# EAGLE design sca (EAGLE 9.5.1)

## Sheet 1 of 4
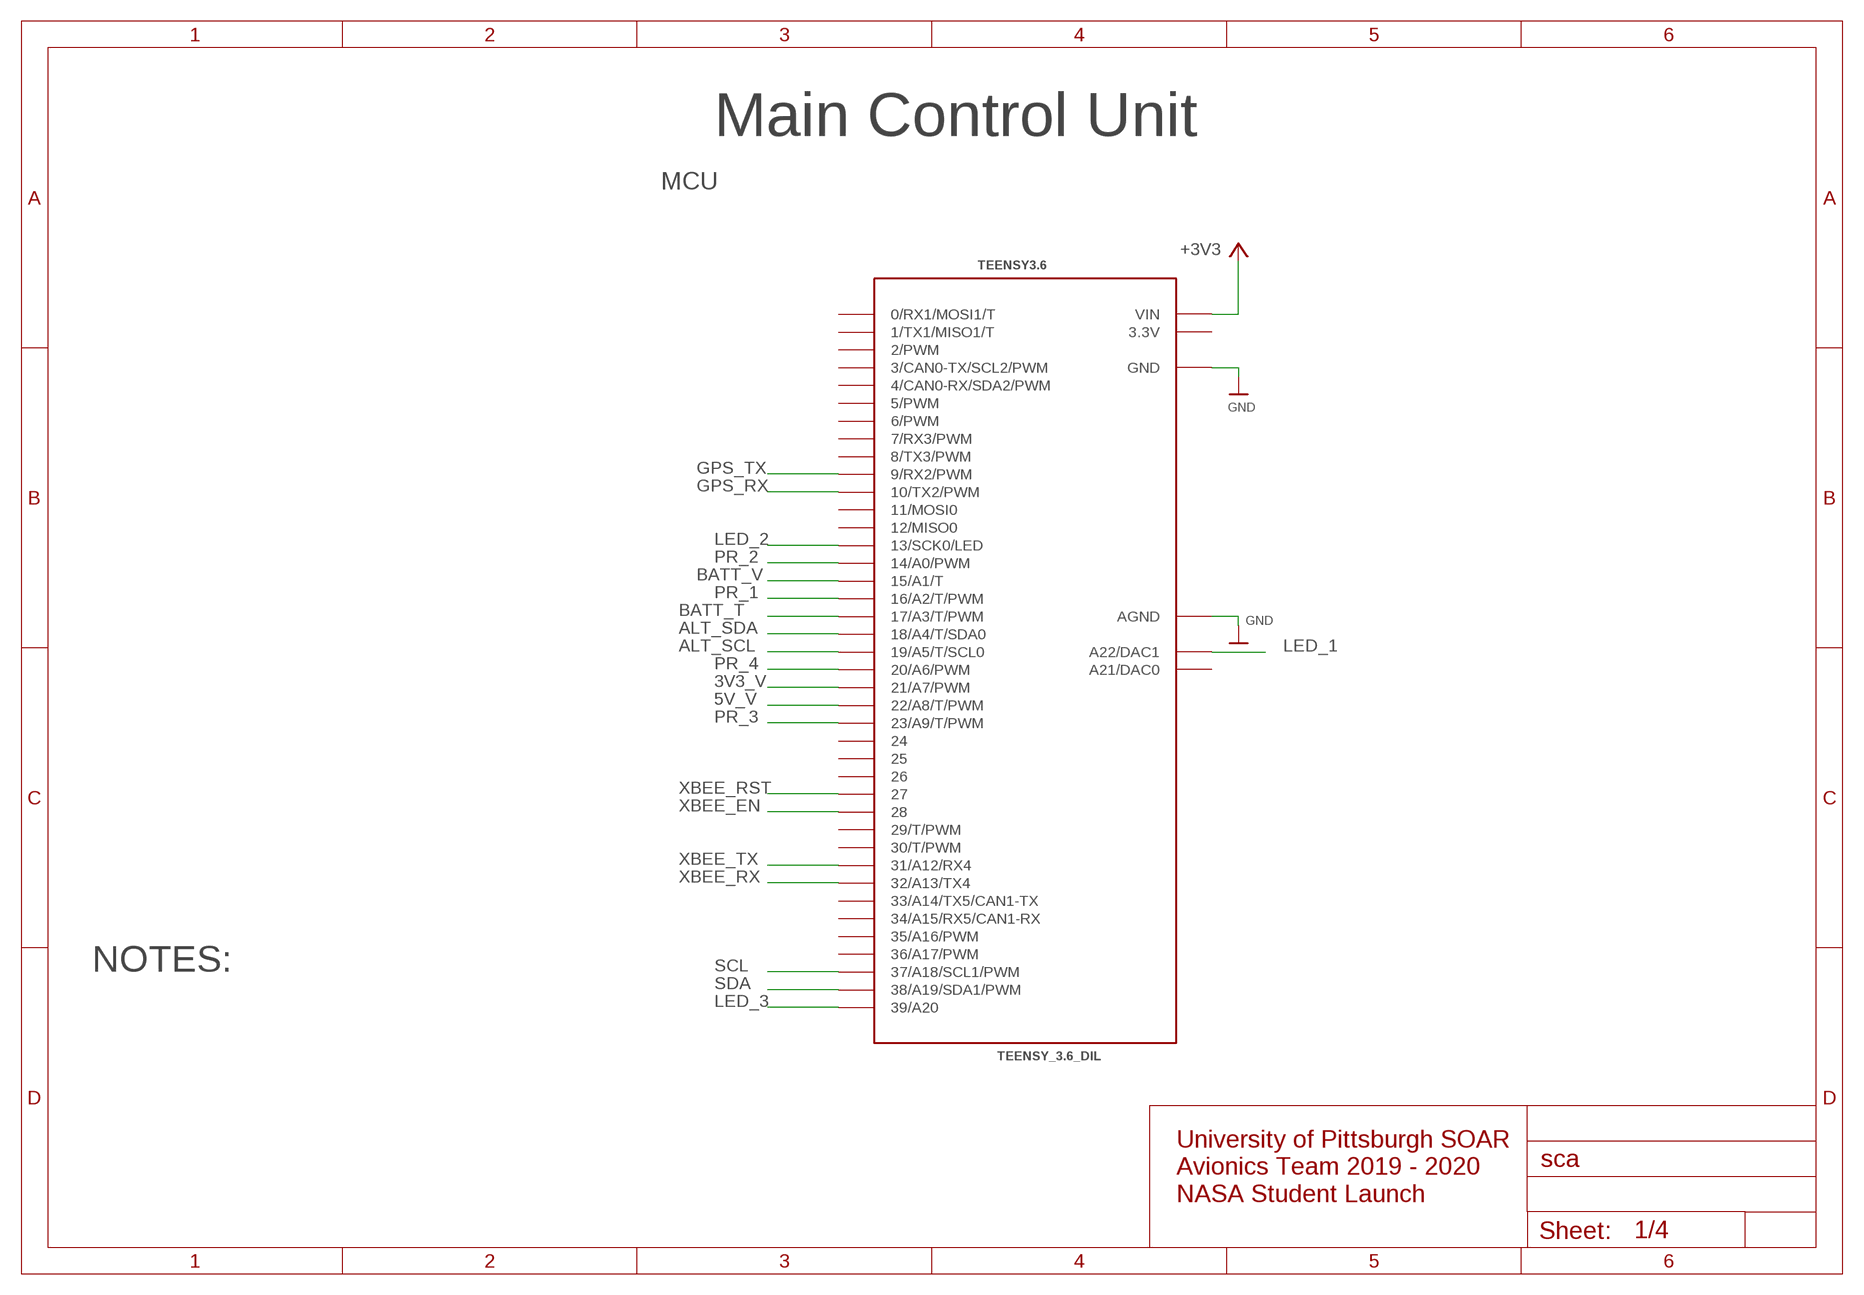
[diagram p0: schematic, sheet 1]

### Parts
TEENSY3.6  TEENSY_3.6_DIL  [TEENSY_3.6_DIL]

### Nets
3V3_V: TEENSY3.6.21/A7(21/A7/PWM) ; also sheet 4
5V_V: TEENSY3.6.22/A8(22/A8/T/PWM) ; also sheet 4
+3V3: TEENSY3.6.VIN ; also sheet 2,3,4
ALT_SCL: TEENSY3.6.19/A5(19/A5/T/SCL0) ; also sheet 3
ALT_SDA: TEENSY3.6.18/A4(18/A4/T/SDA0) ; also sheet 3
BATT_T: TEENSY3.6.17/A3(17/A3/T/PWM) ; also sheet 4
BATT_V: TEENSY3.6.15/A1(15/A1/T) ; also sheet 4
GND: TEENSY3.6.AGND TEENSY3.6.GND TEENSY3.6.GND1(GND) ; also sheet 2,3,4
GPS_RX: TEENSY3.6.10(10/TX2/PWM) ; also sheet 3
GPS_TX: TEENSY3.6.9(9/RX2/PWM) ; also sheet 3
LED_1: TEENSY3.6.A22(A22/DAC1) ; also sheet 4
LED_2: TEENSY3.6.13(13/SCK0/LED) ; also sheet 4
LED_3: TEENSY3.6.39/A20 ; also sheet 4
PR_1: TEENSY3.6.16/A2(16/A2/T/PWM) ; also sheet 4
PR_2: TEENSY3.6.14/A0(14/A0/PWM) ; also sheet 4
PR_3: TEENSY3.6.23/A9(23/A9/T/PWM) ; also sheet 4
PR_4: TEENSY3.6.20/A6(20/A6/PWM) ; also sheet 4
SCL: TEENSY3.6.37/A18(37/A18/SCL1/PWM) ; also sheet 3
SDA: TEENSY3.6.38/A19(38/A19/SDA1/PWM) ; also sheet 3
XBEE_EN: TEENSY3.6.28 ; also sheet 3
XBEE_RST: TEENSY3.6.27 ; also sheet 3
XBEE_RX: TEENSY3.6.32/A13(32/A13/TX4) ; also sheet 3
XBEE_TX: TEENSY3.6.31/A12(31/A12/RX4) ; also sheet 3
Unconnected: TEENSY3.6.0(0/RX1/MOSI1/T) TEENSY3.6.1(1/TX1/MISO1/T) TEENSY3.6.2(2/PWM) TEENSY3.6.3(3/CAN0-TX/SCL2/PWM) TEENSY3.6.4(4/CAN0-RX/SDA2/PWM) TEENSY3.6.5(5/PWM) TEENSY3.6.6(6/PWM) TEENSY3.6.7(7/RX3/PWM) TEENSY3.6.8(8/TX3/PWM) TEENSY3.6.11(11/MOSI0) TEENSY3.6.12(12/MISO0) TEENSY3.6.24 TEENSY3.6.25 TEENSY3.6.26 TEENSY3.6.29(29/T/PWM) TEENSY3.6.30(30/T/PWM) TEENSY3.6.33/A14(33/A14/TX5/CAN1-TX) TEENSY3.6.34/A15(34/A15/RX5/CAN1-RX) TEENSY3.6.35/A16(35/A16/PWM) TEENSY3.6.36/A17(36/A17/PWM) TEENSY3.6.A21(A21/DAC0)

### Notes on the sheet
- Main Control Unit
- MCU
- NOTES:
- University of Pittsburgh SOAR
  Avionics Team 2019 - 2020
  NASA Student Launch

## Sheet 2 of 4
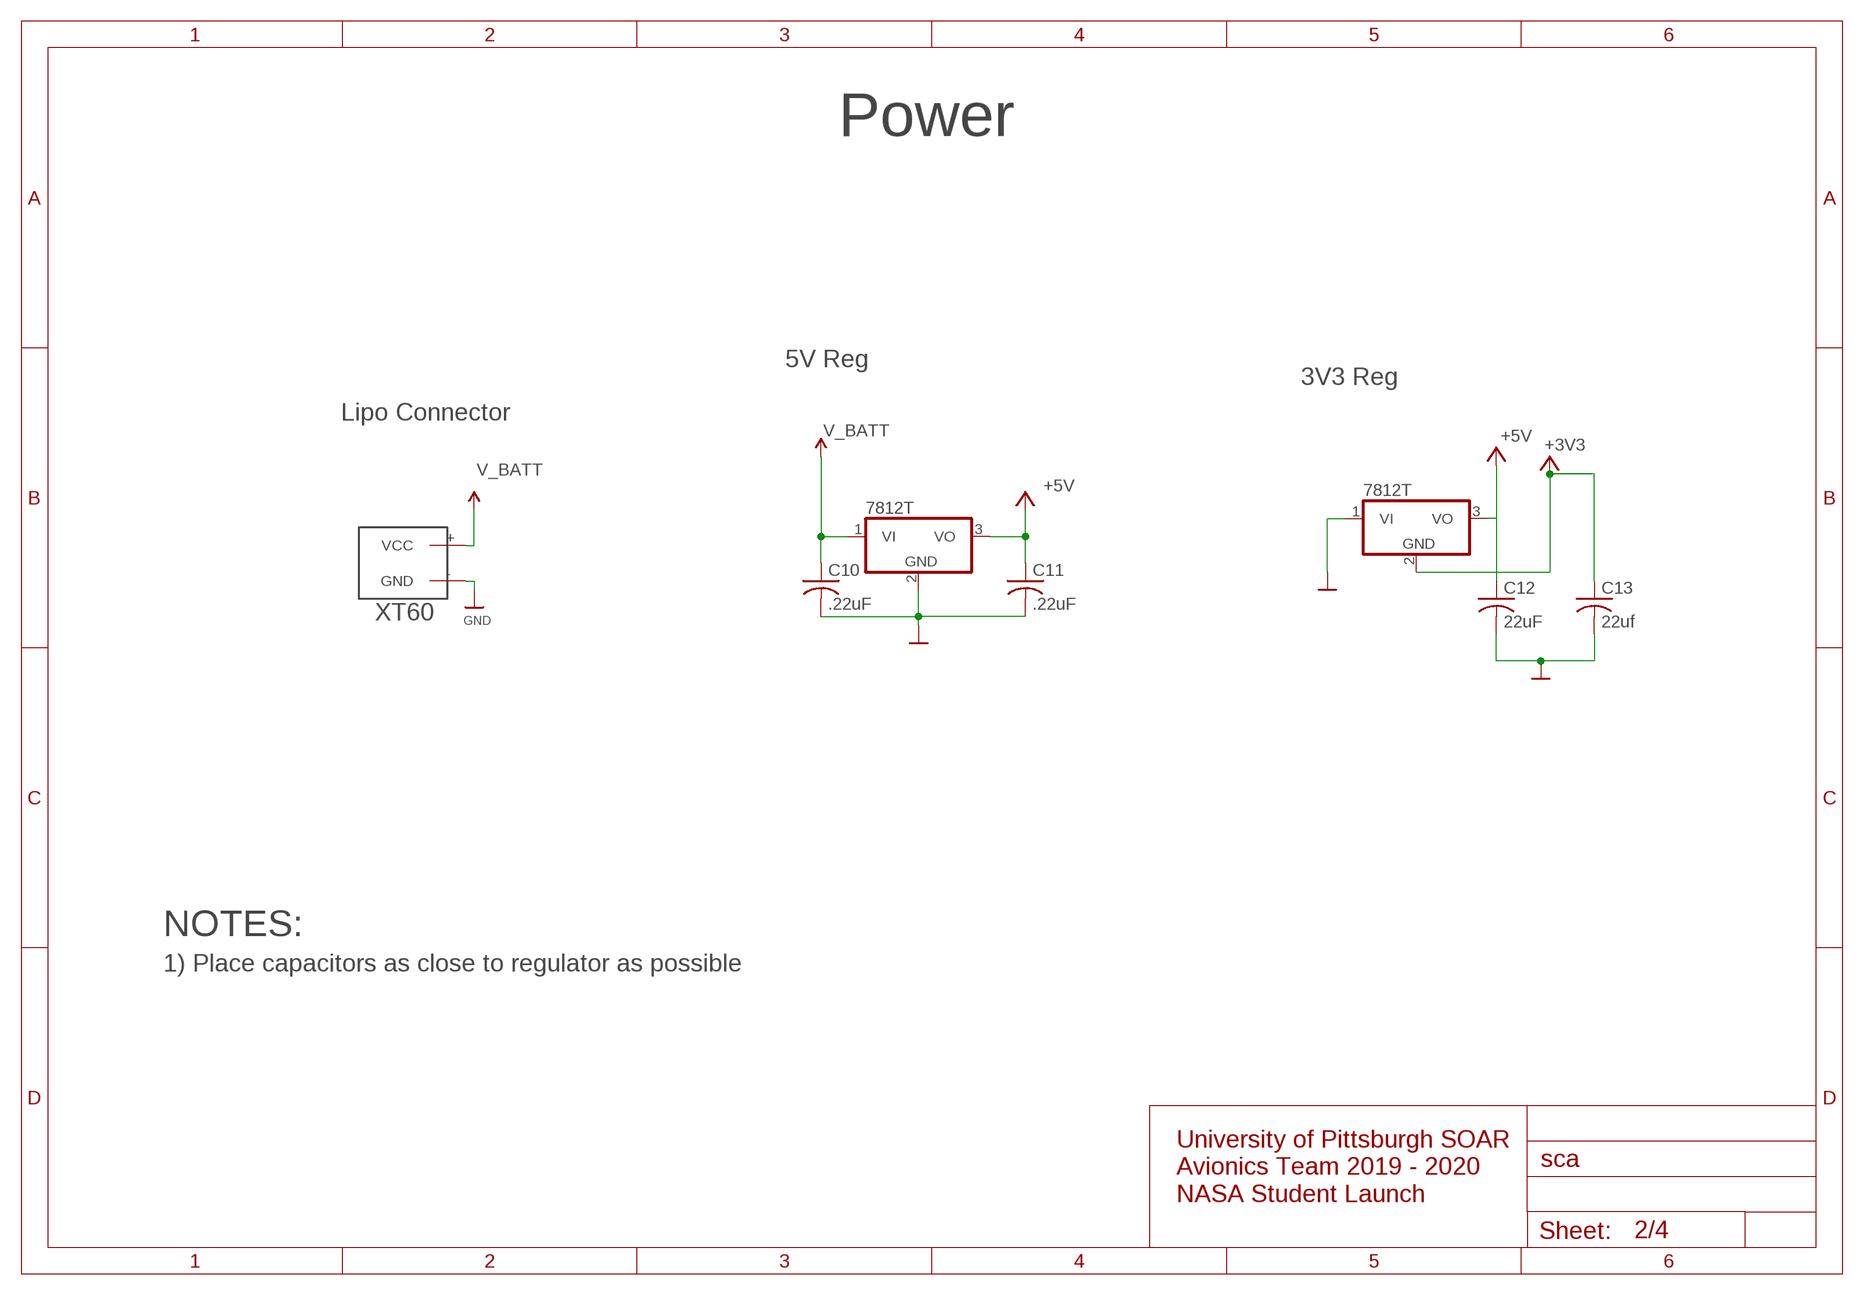
[diagram p1: schematic, sheet 2]

### Parts
3V3_REG  7812T  [TO220H]
5V_REG  7812T  [TO220H]
C10  .22uF  C-US025-040X050  [C025-040X050]
C11  .22uF  C-US025-040X050  [C025-040X050]
C12  22uF  C-US025-040X050  [C025-040X050]
C13  22uf  C-US025-040X050  [C025-040X050]
U$5  XT60  [XT60]

### Nets
+3V3: 3V3_REG.2(GND) C13.1 ; also sheet 1,3,4
+5V: 3V3_REG.3(VO) 5V_REG.3(VO) C11.1 C12.1 ; also sheet 3,4
GND: 3V3_REG.1(VI) 5V_REG.2(GND) C10.2 C11.2 C12.2 C13.2 U$5.-(GND) ; also sheet 1,3,4
V_BATT: 5V_REG.1(VI) C10.1 U$5.+(VCC) ; also sheet 4

### Notes on the sheet
- Power
- 5V Reg
- 3V3 Reg
- Lipo Connector
- NOTES:
- 1) Place capacitors as close to regulator as possible
- University of Pittsburgh SOAR
  Avionics Team 2019 - 2020
  NASA Student Launch

## Sheet 3 of 4
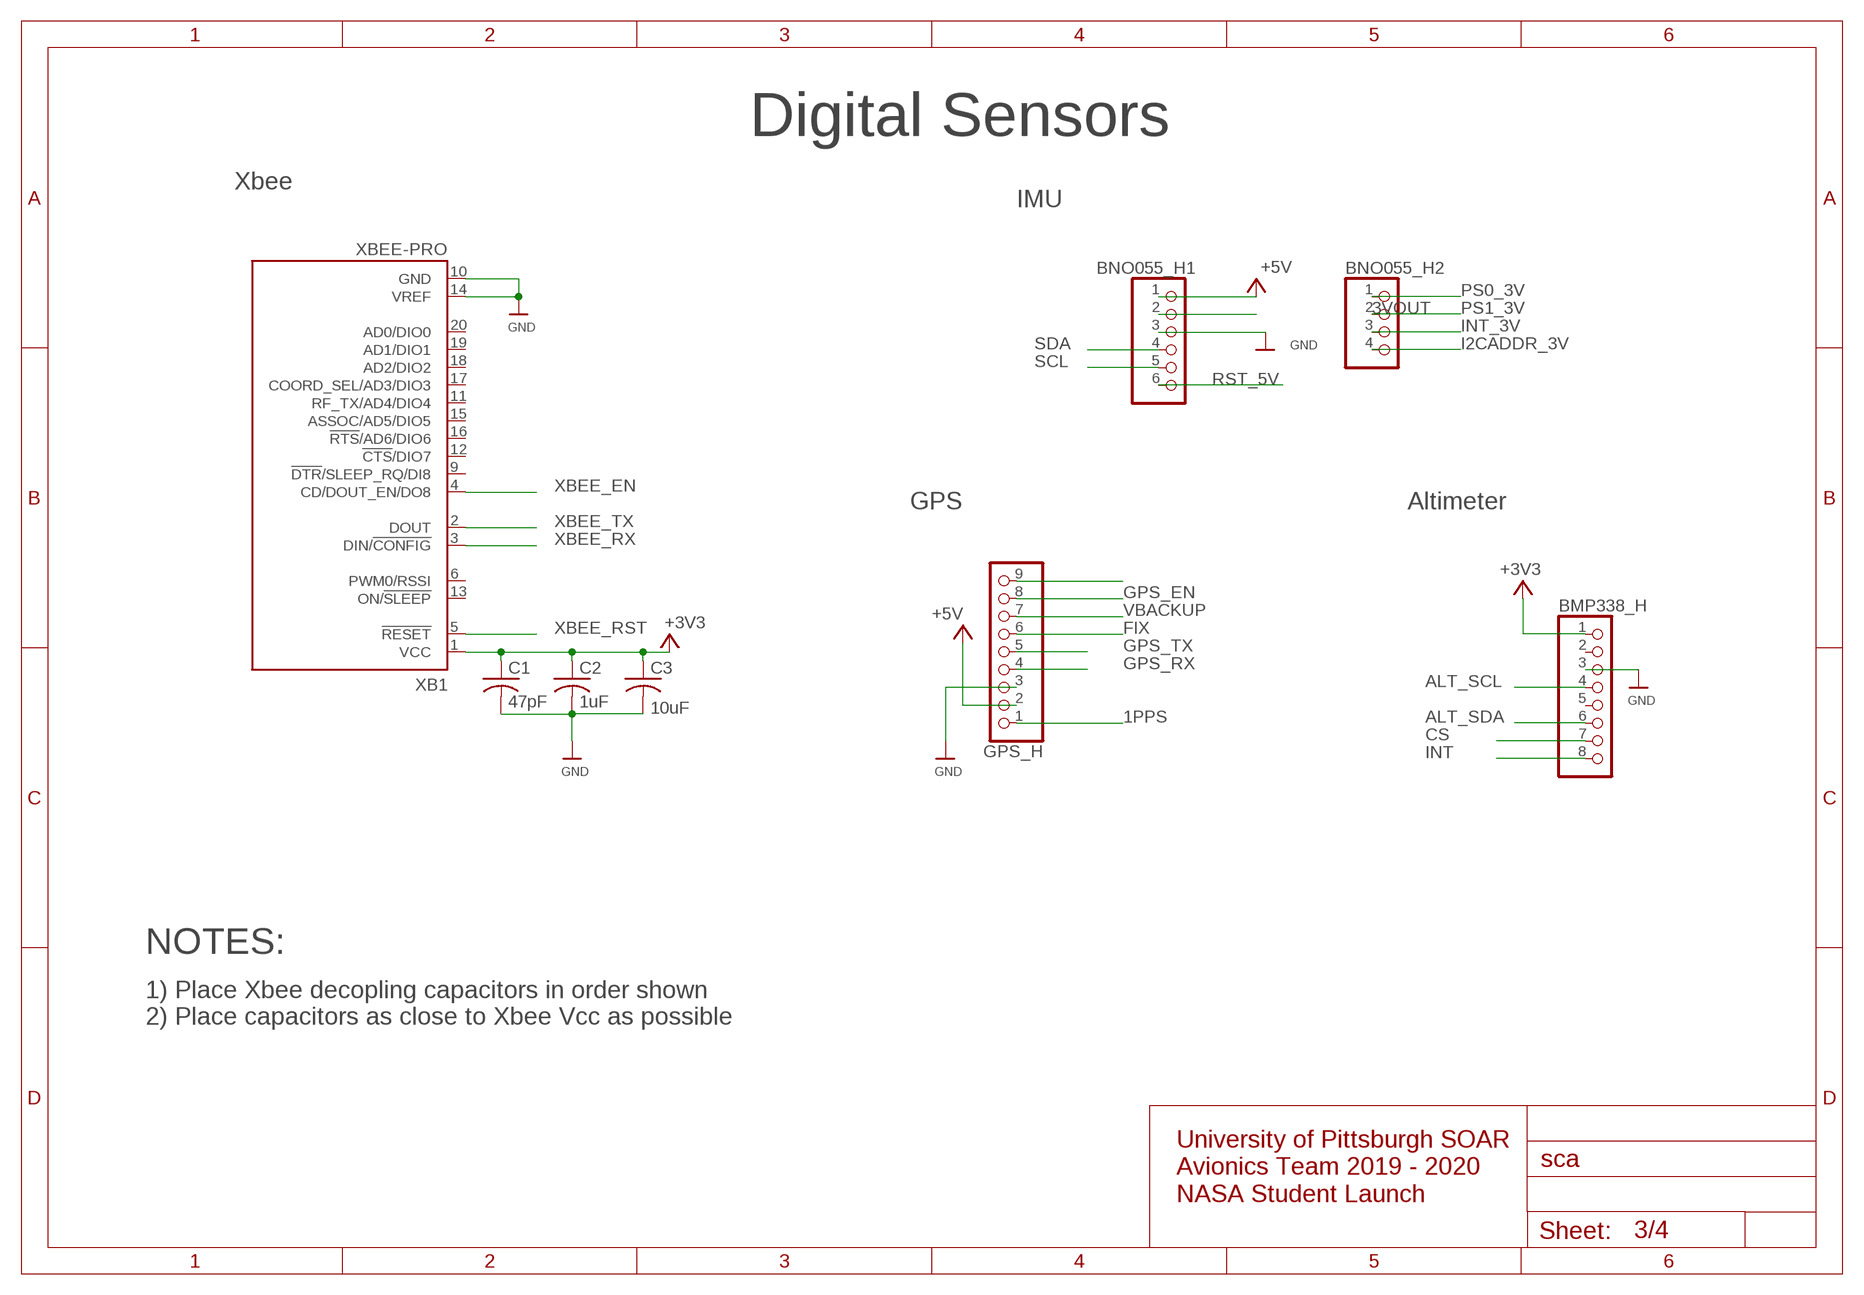
[diagram p2: schematic, sheet 3]

### Parts
BMP338_H  HEADER-1X870MIL  [1X08_ROUND_70]
BNO055_H1  HEADER-1X676MIL  [1X06_ROUND_76]
BNO055_H2  HEADER-1X476MIL  [1X04_ROUND_76]
C1  47pF  C-US025-040X050  [C025-040X050]
C2  1uF  C-US025-040X050  [C025-040X050]
C3  10uF  C-US025-040X050  [C025-040X050]
GPS_H  HEADER-1X970MIL  [1X09_ROUND_70]
XB1  XBEE-PRO  [XBEE-PRO]

### Nets
1PPS: GPS_H.1
3VOUT: BNO055_H1.2
+3V3: BMP338_H.1 C1.1 C2.1 C3.1 XB1.1(VCC) ; also sheet 1,2,4
+5V: BNO055_H1.1 GPS_H.2 ; also sheet 2,4
ALT_SCL: BMP338_H.4 ; also sheet 1
ALT_SDA: BMP338_H.6 ; also sheet 1
CS: BMP338_H.7
FIX: GPS_H.6
GND: BMP338_H.3 BNO055_H1.3 C1.2 C2.2 C3.2 GPS_H.3 XB1.10(GND) XB1.14(VREF) ; also sheet 1,2,4
GPS_EN: GPS_H.8
GPS_RX: GPS_H.4 ; also sheet 1
GPS_TX: GPS_H.5 ; also sheet 1
I2CADDR_3V: BNO055_H2.4
INT: BMP338_H.8
INT_3V: BNO055_H2.3
N$3: GPS_H.9
PS0_3V: BNO055_H2.1
PS1_3V: BNO055_H2.2
RST_5V: BNO055_H1.6
SCL: BNO055_H1.5 ; also sheet 1
SDA: BNO055_H1.4 ; also sheet 1
VBACKUP: GPS_H.7
XBEE_EN: XB1.4(CD/DOUT_EN/DO8) ; also sheet 1
XBEE_RST: XB1.5(!RESET) ; also sheet 1
XBEE_RX: XB1.3(DIN/!CONFIG) ; also sheet 1
XBEE_TX: XB1.2(DOUT) ; also sheet 1
Unconnected: BMP338_H.2 BMP338_H.5 XB1.6(PWM0/RSSI) XB1.9(!DTR!/SLEEP_RQ/DI8) XB1.11(RF_TX/AD4/DIO4) XB1.12(!CTS!/DIO7) XB1.13(ON/!SLEEP) XB1.15(ASSOC/AD5/DIO5) XB1.16(!RTS!/AD6/DIO6) XB1.17(COORD_SEL/AD3/DIO3) XB1.18(AD2/DIO2) XB1.19(AD1/DIO1) XB1.20(AD0/DIO0)

### Notes on the sheet
- Digital Sensors
- Xbee
- IMU
- GPS | Altimeter
- NOTES:
- 1) Place Xbee decopling capacitors in order shown
  2) Place capacitors as close to Xbee Vcc as possible
- University of Pittsburgh SOAR
  Avionics Team 2019 - 2020
  NASA Student Launch

## Sheet 4 of 4
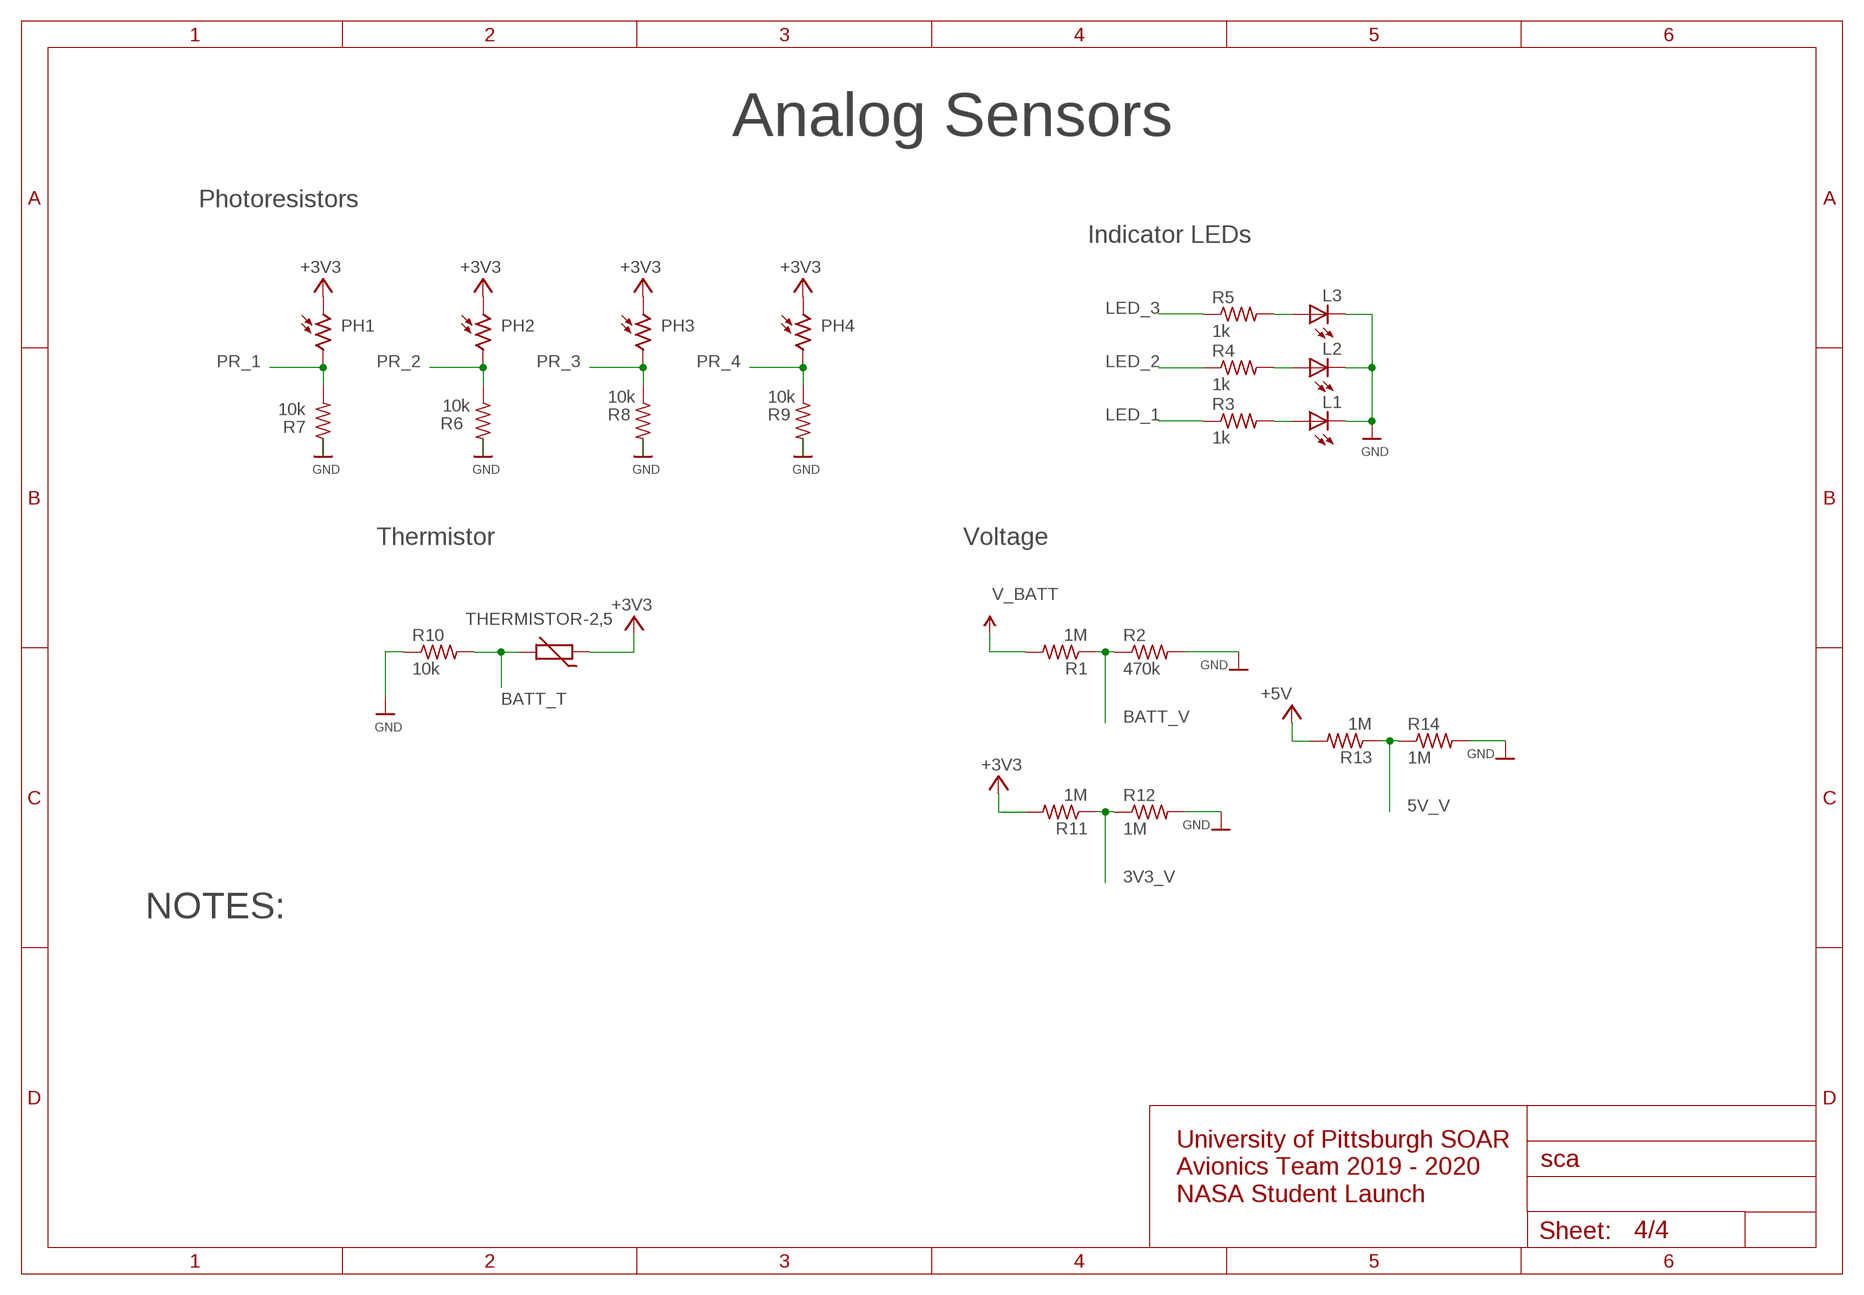
[diagram p3: schematic, sheet 4]

### Parts
L1  LED3MM  [LED3MM]
L2  LED3MM  [LED3MM]
L3  LED3MM  [LED3MM]
PH1  A1050_09  [T0-46-A10XX]
PH2  A1050_09  [T0-46-A10XX]
PH3  A1050_09  [T0-46-A10XX]
PH4  A1050_09  [T0-46-A10XX]
R1  1M  R-US_0309/10  [0309/10]
R2  470k  R-US_0309/10  [0309/10]
R3  1k  R-US_0309/10  [0309/10]
R4  1k  R-US_0309/10  [0309/10]
R5  1k  R-US_0309/10  [0309/10]
R6  10k  R-US_0309/10  [0309/10]
R7  10k  R-US_0309/10  [0309/10]
R8  10k  R-US_0309/10  [0309/10]
R9  10k  R-US_0309/10  [0309/10]
R10  10k  R-US_0309/10  [0309/10]
R11  1M  R-US_0309/10  [0309/10]
R12  1M  R-US_0309/10  [0309/10]
R13  1M  R-US_0309/10  [0309/10]
R14  1M  R-US_0309/10  [0309/10]
R20  THERMISTOR-2,5  [RS-2,5]

### Nets
3V3_V: R11.1 R12.1 ; also sheet 1
5V_V: R13.1 R14.1 ; also sheet 1
+3V3: PH1.1 PH2.1 PH3.1 PH4.1 R11.2 R20.1 ; also sheet 1,2,3
+5V: R13.2 ; also sheet 2,3
BATT_T: R10.2 R20.2 ; also sheet 1
BATT_V: R1.1 R2.1 ; also sheet 1
GND: L1.K(C) L2.K(C) L3.K(C) R2.2 R6.2 R7.1 R8.2 R9.2 R10.1 R12.2 R14.2 ; also sheet 1,2,3
LED_1: R3.1 ; also sheet 1
LED_2: R4.1 ; also sheet 1
LED_3: R5.1 ; also sheet 1
N$7: L1.A R3.2
N$8: L2.A R4.2
N$13: L3.A R5.2
PR_1: PH1.2 R7.2 ; also sheet 1
PR_2: PH2.2 R6.1 ; also sheet 1
PR_3: PH3.2 R8.1 ; also sheet 1
PR_4: PH4.2 R9.1 ; also sheet 1
V_BATT: R1.2 ; also sheet 2

### Notes on the sheet
- Analog Sensors
- Photoresistors
- Indicator LEDs
- Thermistor | Voltage
- NOTES:
- University of Pittsburgh SOAR
  Avionics Team 2019 - 2020
  NASA Student Launch

## Power pins joined to a net without a drawn wire
3.3V: TEENSY3.6.3.3V TEENSY3.6.3.3V3(3.3V)

## Library data of the parts
3V3_REG 5V_REG = adafruit:78*: Positive VOLTAGE REGULATOR Added bigger pads to the TO-92 package
BMP338_H = microbuilder:HEADER-1X8: PIN HEADER
BNO055_H1 = microbuilder:HEADER-1X6: PIN HEADER
BNO055_H2 = microbuilder:HEADER-1X4: PIN HEADER
C1-C3 C10-C13 = adafruit:C-US: CAPACITOR, American symbol
GPS_H = microbuilder:HEADER-1X9: PIN HEADER
L1-L3 = adafruit:LED: LED OSRAM: - CHIPLED LG R971, LG N971, LY N971, LG Q971, LY Q971, LO R971, LY R971 LH N974, LH R974 LS Q976, LO Q976, LY Q976 LO Q996 - Hyper CHIPLED LW Q18S LB Q993, LB Q99A, LB R99A - SideLED LS A670, LO A670, LY A670, LG A670, LP A670 LB A673, LV A673, LT A673, LW A673 LH A674 LY A675 LS A676, LA A676, LO A676, LY A676, LW A676 LS A679, LY A679, LG A679 - Hyper Micro SIDELED® LS Y876, LA Y876, LO Y876, LY Y876 LT Y87S - SmartLED LW L88C, LW L88S LB L89C, LB L89S, LG L890 LS L89K, LO L89K, LY L89K LS L896, LA L896, LO L896, LY L896 - TOPLED LS T670, LO T670, LY T670, LG T670, LP T670 LSG T670, LSP T670, LSY T670, LOP T670, LYG T670 LG T671, LOG T671, LSG T671 LB T673, LV T673, LT T673, LW T673 LH T674 LS T676, LA T676, LO T676, LY T676, LB T676, LH T676, LSB T676, LW T676 LB T67C, LV T67C, LT T67C, LS T67K, LO T67K, LY T67K, LW E67C LS E67B, LA E67B, LO E67B, LY E67B, LB E67C, LV E67C, LT E67C LW T67C LS T679, LY T679, LG T679 LS T770, LO T770, LY T770, LG T770, LP T770 LB T773, LV T773, LT T773, LW T773 LH T774 LS E675, LA E675, LY E675, LS T675 LS T776, LA T776, LO T776, LY T776, LB T776 LHGB T686 LT T68C, LB T68C - Hyper Mini TOPLED® LB M676 - Mini TOPLED Santana® LG M470 LS M47K, LO M47K, LY M47K Source: http://www.osram.convergy.de/
PH1-PH4 = photo-elements:A10: Sensor Robust Light Sensing Applications Outdoor Light Sensing Application Source: http://optoelectronics.perkinelmer.com/content/Datasheets/DTS_PhotocellsA1050.pdf
R1-R14 = resistor:R-US_: RESISTOR, American symbol
R20 = varistor:THERMISTOR: THERMISTOR
TEENSY3.6 = Teensy_3_and_LC_Series_Boards_v1.4:TEENSY_3.6_DIL: Teensy 3.6 DIL Package
U$5 = XT60:XT60: XT60
XB1 = maxstream:XBEE: XBee (TM) /XBee-PRO(TM) OEM RF Modules Source: MaxStream, Inc. xbee_productmanual.pdf; MPN: XBP24-AWI-001; OC_FARNELL: 1337916; OC_NEWARK: 42M2667

## Board
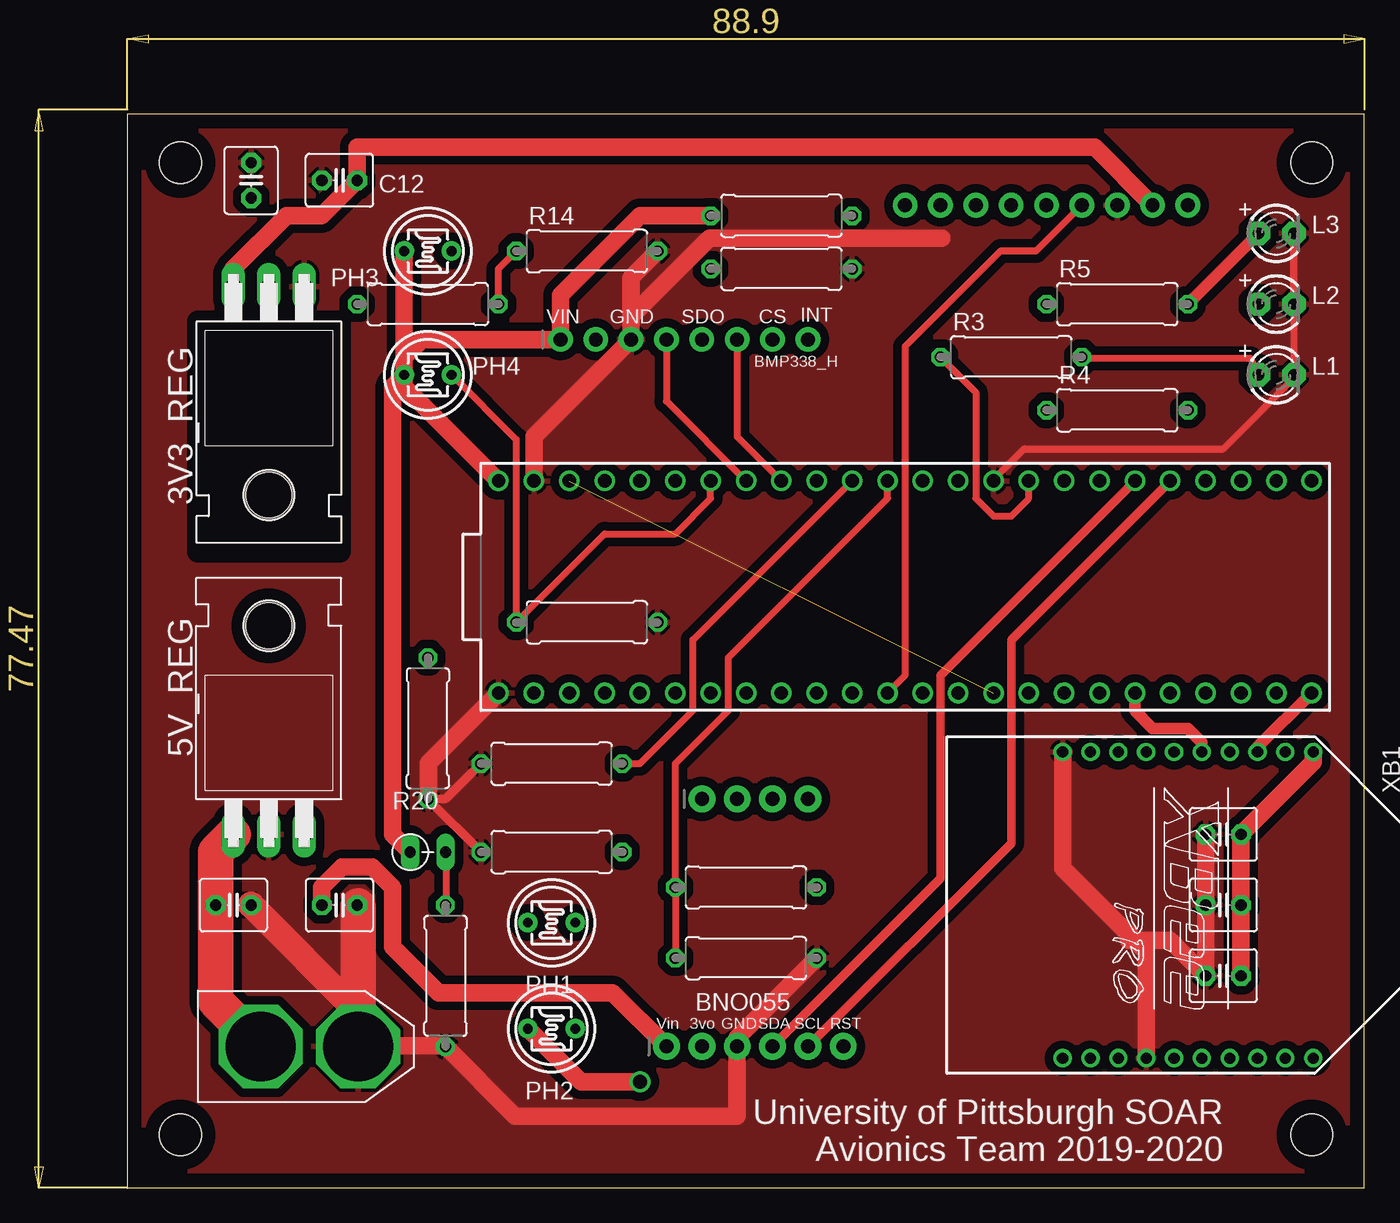
[diagram p4: board, top side]
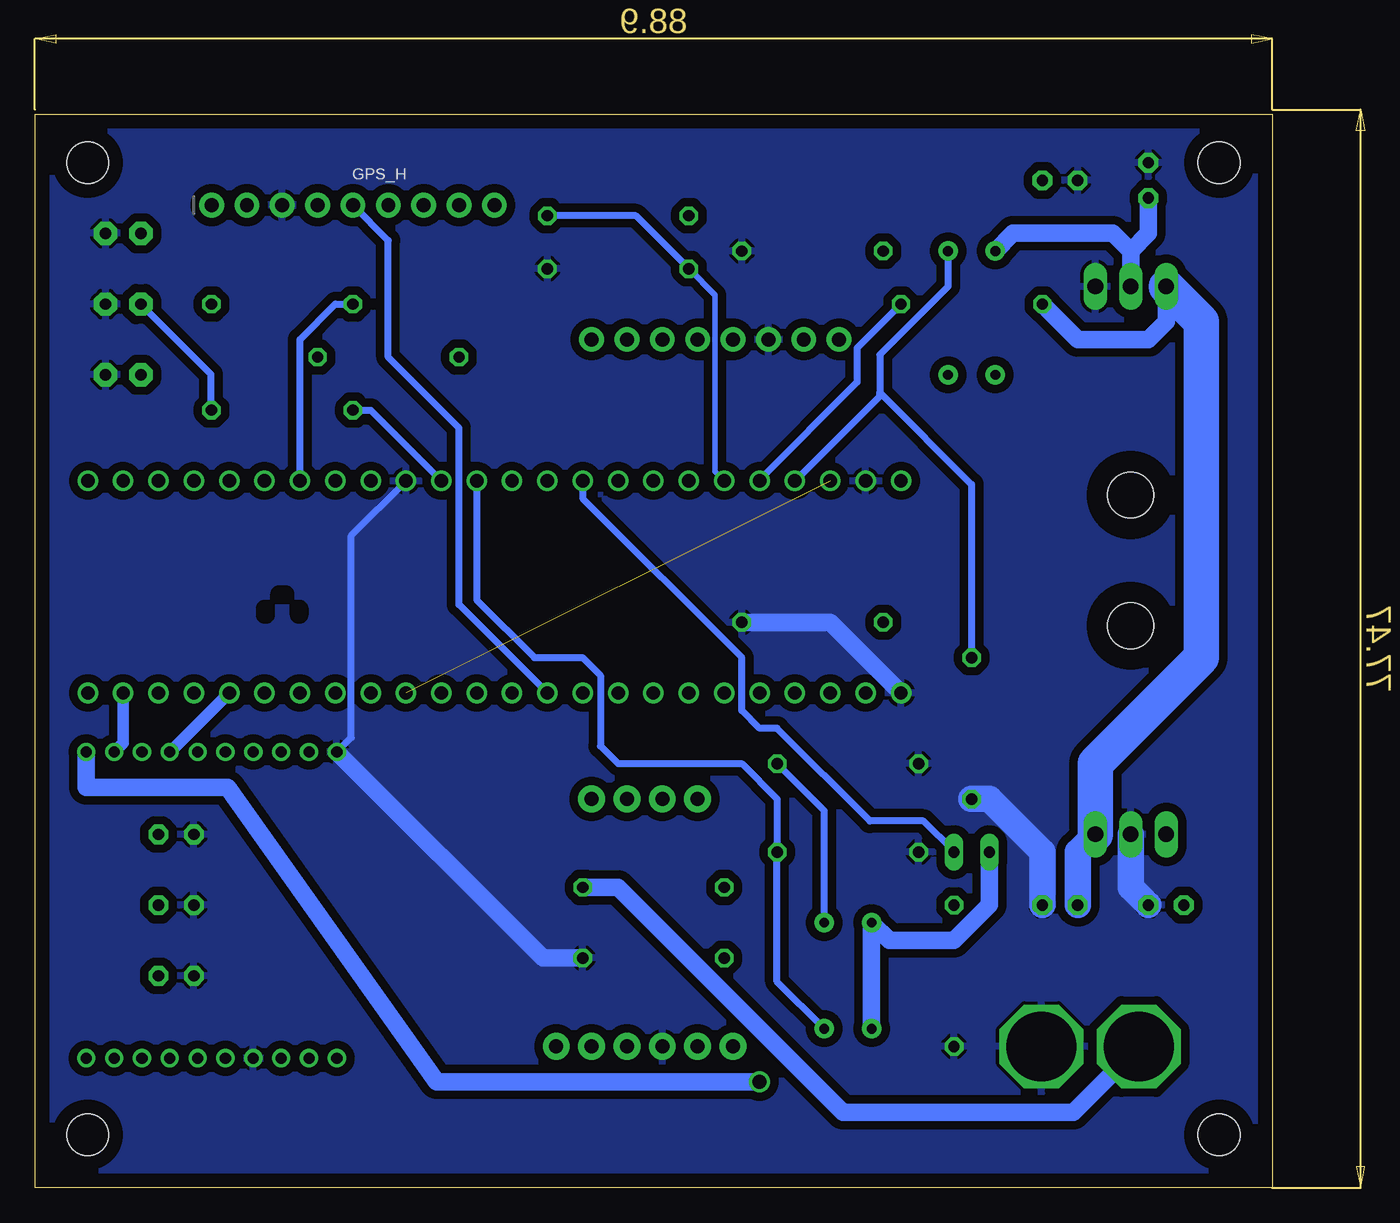
[diagram p5: board, bottom side, seen from below]

Size 88.88 x 77.14 mm. Coordinates in mm from the lower left corner, seen from the top.
Outline: 0,0 88.88,0 88.88,77.14 0,77.14 0,0
Copper layers (1*16): Top 0.035mm / dielectric 1.5mm / Bottom 0.035mm
Design rules "default *": minimum track width 16mil, minimum drill 0.35mm, track to track 6mil, track to pad 6mil, pad to pad 6mil, via to via 6mil, smd to smd 6mil, copper to edge 40mil, drill to drill 6mil, minimum pad ring 10mil, minimum via ring 8mil, stop-mask expansion 4mil, vias tented up to drill 0mil, thermal gap 10mil
Holes 3 mm at 85.09,73.66 85.09,3.81 3.81,3.81 3.81,73.66
tRestrict: area 5.1,45.7 to 15.2,62.2
bRestrict: area 70.9,42.5 to 71.4,42.7; area 69.8,41.1 to 70,41.7; area 72.3,41.1 to 72.4,41.7

### Footprints (pad centres in the part's own frame; a part is rotated, then mirrored left to right if it is on the bottom)
TO220H = drill 1.118 long: 1 -2.54,-10.16; 2 0,-10.16; 3 2.54,-10.16 | hole 3.302: 0,4.826
1X08_ROUND_70 = drill 1 pad 1.778: 1 -8.89,0; 2 -6.35,0; 3 -3.81,0; 4 -1.27,0; 5 1.27,0; 6 3.81,0; 7 6.35,0; 8 8.89,0
1X06_ROUND_76 = drill 1 pad 1.93: 1 -6.35,0; 2 -3.81,0; 3 -1.27,0; 4 1.27,0; 5 3.81,0; 6 6.35,0
1X04_ROUND_76 = drill 1 pad 1.93: 1 -3.81,0; 2 -1.27,0; 3 1.27,0; 4 3.81,0
C025-040X050 = drill 0.813 pad 1.422 octagon: 1 -1.27,0; 2 1.27,0
1X09_ROUND_70 = drill 1 pad 1.778: 1 -10.16,0; 2 -7.62,0; 3 -5.08,0; 4 -2.54,0; 5 0,0; 6 2.54,0; 7 5.08,0; 8 7.62,0; 9 10.16,0
LED3MM = drill 0.813 pad 1.676 octagon: A -1.27,0; K 1.27,0
T0-46-A10XX = drill 0.7 pad 1.4: 1 -1.7,0; 2 1.7,0
0309/10 = drill 0.813 octagon: 1 -5.08,0; 2 5.08,0
RS-2,5 = drill 0.813 long: 1 -1.27,0; 2 1.27,0
TEENSY_3.6_DIL = drill 0.965: 0 -7.62,25.4; 1 -7.62,22.86; 2 -7.62,20.32; 3 -7.62,17.78; 3.3V 7.62,22.86; 3.3V3 -7.62,-7.62; 4 -7.62,15.24; 5 -7.62,12.7; 6 -7.62,10.16; 7 -7.62,7.62; 8 -7.62,5.08; 9 -7.62,2.54; 10 -7.62,0; 11 -7.62,-2.54; 12 -7.62,-5.08; 13 7.62,-5.08; 14/A0 7.62,-2.54; 15/A1 7.62,0; 16/A2 7.62,2.54; 17/A3 7.62,5.08; 18/A4 7.62,7.62; 19/A5 7.62,10.16; 20/A6 7.62,12.7; 21/A7 7.62,15.24; 22/A8 7.62,17.78; 23/A9 7.62,20.32; 24 -7.62,-10.16; 25 -7.62,-12.7; 26 -7.62,-15.24; 27 -7.62,-17.78; 28 -7.62,-20.32; 29 -7.62,-22.86; 30 -7.62,-25.4; 31/A12 -7.62,-27.94; 32/A13 -7.62,-30.48; 33/A14 7.62,-30.48; 34/A15 7.62,-27.94; 35/A16 7.62,-25.4; 36/A17 7.62,-22.86; 37/A18 7.62,-20.32; 38/A19 7.62,-17.78; 39/A20 7.62,-15.24; A21 7.62,-12.7; A22 7.62,-10.16; AGND 7.62,25.4; GND -7.62,27.94; GND1 7.62,-7.62; VIN 7.62,27.94
XT60 = drill 5 octagon: + 4.5,0; - 11.5,0
XBEE-PRO = drill 0.8 pad 1.27: 1 -11,9; 2 -11,7; 3 -11,5; 4 -11,3; 5 -11,1; 6 -11,-1; 7 -11,-3; 8 -11,-5; 9 -11,-7; 10 -11,-9; 11 11,-9; 12 11,-7; 13 11,-5; 14 11,-3; 15 11,-1; 16 11,1; 17 11,3; 18 11,5; 19 11,7; 20 11,9

### Placement (x,y rotation side)
3V3_REG  10.16,54.61 180 top
5V_REG  10.16,35.56 0 top
BMP338_H  40.01,60.96 0 top
BNO055_H1  45.09,10.16 0 top
BNO055_H2  45.09,27.94 0 top
C1  78.74,25.4 180 top
C2  78.74,20.32 180 top
C3  78.74,15.24 180 top
C10  7.62,20.32 0 top
C11  15.24,20.32 0 top
C12  15.24,72.39 180 top
C13  8.89,72.39 90 top
GPS_H  66.04,70.61 0 bottom
L1  82.55,58.42 0 top
L2  82.55,63.5 0 top
L3  82.55,68.58 0 top
PH1  30.48,19.05 0 top
PH2  30.48,11.43 0 top
PH3  21.59,67.31 0 top
PH4  21.59,58.42 0 top
R1  44.45,21.59 0 top
R2  44.45,16.51 0 top
R3  63.5,59.69 0 top
R4  71.12,55.88 0 top
R5  71.12,63.5 0 top
R6  30.48,24.13 180 top
R7  30.48,30.48 0 top
R8  21.59,33.02 270 top
R9  33.02,40.64 0 top
R10  22.86,15.24 90 top
R11  46.99,69.85 180 top
R12  46.99,66.04 0 top
R13  21.59,63.5 180 top
R14  33.02,67.31 0 top
R20  21.59,24.13 0 top
TEENSY3.6  54.61,43.18 90 top
U$5  5.08,10.16 0 top
XB1  76.2,20.32 270 top

### Tracks (layer width: path | path; a pad name or v marks a point on that pad's centre or on a via)
3.3V  (1 unrouted)
3V3_V
  Bottom 0.406: R12.1 40.03,64.16 40.03,51.46 TEENSY3.6.21/A7
  Bottom 0.508: R12.1 45.72,69.85 R11.1
5V_V
  Top 0.508: R13.1 26.67,66.04 R14.1
  Bottom 0.508: R13.1 29.82,60.35 29.82,57.88 36.83,50.87 TEENSY3.6.22/A8
+3V3  (via drill 1)
  Top 1.016: 30.99,60.96 BMP338_H.1
  Top 1.27: PH4.1 19.05,57.58 19.05,25.4 R20.1 | PH4.1 19.89,59.69 21.16,60.96 30.99,60.96 | TEENSY3.6.VIN 19.89,57.58 PH4.1 | PH2.1 32.59,7.62 v36.83,7.62 | PH3.1 PH4.1 | C3.1 C2.1 C1.1 85.2,30.59 XB1.1 | R11.2 36.83,69.85 31.11,64.14 BMP338_H.1
  Bottom 1.27: XB1.1 85.2,28.78 75.04,28.78 60.04,7.62 v36.83,7.62 | PH2.1 PH1.1 27.51,17.78 22.86,17.78 20.32,20.32 R20.1 | 3V3_REG.2 10.16,67.31 | 10.16,67.31 11.43,68.58 18.62,68.58 PH3.1 | C13.1 8.89,68.58 10.16,67.31
+5V
  Top 1.27: C11.1 13.97,21.59 15.44,23.06 17.58,23.06 19.05,21.59 19.05,17.32 22.35,14.02 34.87,14.02 BNO055_H1.1 | GPS_H.2 69.51,74.77 16.51,74.77 C12.1 13.97,69.85 11.43,69.85 7.62,66.04 3V3_REG.3
  Bottom 1.27: R13.2 13.97,60.96 8.89,60.96 7.62,62.23 3V3_REG.3
  Bottom 1.905: 5V_REG.3 13.97,24.13 C11.1
  Bottom 2.54: 5V_REG.3 12.7,30.48 5.08,38.1 5.08,62.23 3V3_REG.3
ALT_SCL
  Top 0.508: BMP338_H.4 38.74,56.52 TEENSY3.6.19/A5
ALT_SDA
  Top 0.508: BMP338_H.6 43.82,53.98 TEENSY3.6.18/A4
BATT_T
  Top 0.508: R20.2 22.91,24.08 22.91,20.37 R10.2
  Bottom 0.508: R20.2 22.91,24.23 25.04,26.36 28.91,26.36 35.56,33.02 36.83,33.02 38.1,34.29 38.1,38.1 49.53,49.53 TEENSY3.6.17/A3
BATT_V
  Top 0.508: R2.1 R1.1 39.37,30.48 43.18,34.29 43.18,38.1 54.61,49.53 TEENSY3.6.15/A1
GND
  Top 0.508: BMP338_H.3 36.2,62.61 | L2.K L3.K L1.K 84.07,58.42 78.74,53.09 64.41,53.09 62.23,50.9 TEENSY3.6.GND1 | 22.86,10.21 R10.1 | R8.2 21.64,27.96 21.64,27.89 | BNO055_H1.3 43.82,10.79
  Top 0.61: R7.1 22.86,27.94 R8.2 | R6.2 21.64,27.89
  Top 1.27: 16.58,20.25 C11.2 | 36.2,62.61 41.81,68.22 58.52,68.22 | TEENSY3.6.GND 21.64,30.53 21.64,27.96 | 17.73,10.21 22.86,10.21 | 43.82,10.79 R2.2 | R10.1 27.86,5.16 43.82,5.16 BNO055_H1.3 | TEENSY3.6.AGND 29.21,53.98 BMP338_H.3 36.2,65.41 R14.2 | XB1.14 73.2,16.97 67.2,22.97 XB1.10 | 71.93,17.78 74.93,17.78 C3.2 C2.2 C1.2
  Top 1.905: C10.2 16.58,12.63
  Top 2.54: U$5.- 16.58,20.25 | 16.58,12.63 U$5.- | 17.73,10.21 U$5.-
  Bottom 0.508: BMP338_H.3 36.2,61.29 | TEENSY3.6.GND1 66.17,46.86 66.17,32.35 XB1.10
  Bottom 1.27: R9.2 31.75,40.64 TEENSY3.6.GND | XB1.10 52.39,16.51 R2.2
  Bottom 1.905: C10.2 10.16,21.59 5V_REG.2 | C11.2 16.51,24.13 20.32,27.94 R8.2
  pour Top (isolate 0.61): 0,77.47 88.9,77.47 88.9,0 0,0
  pour Bottom (isolate 0.61): 0,77.47 88.9,77.47 88.9,0 0,0
GPS_RX
  Top 0.508: TEENSY3.6.10 55.88,36.83 55.88,60.45 62.74,67.31 65.28,67.31 GPS_H.4
GPS_TX
  Bottom 0.508: TEENSY3.6.9 58.42,41.91 58.42,53.34 58.42,54.61 63.5,59.69 63.5,68.07 GPS_H.5
LED_1
  Top 0.508: R3.1 60.96,57.15 60.96,49.53 62.23,48.26 63.5,48.26 64.77,49.53 TEENSY3.6.A22
LED_2
  Bottom 0.508: R4.1 64.77,55.88 TEENSY3.6.13
LED_3
  Bottom 0.508: TEENSY3.6.39/A20 69.85,60.96 67.31,63.5 R5.1
N$7
  Top 0.508: R3.2 68.68,59.59 80.7,59.59 L1.A
N$8
  Bottom 0.508: L2.A 76.25,58.47 76.25,55.93 R4.2
N$13
  Top 0.813: R5.2 L3.A
PR_1
  Top 0.508: R7.2 36.83,30.48 40.64,34.29 40.64,39.37 TEENSY3.6.16/A2
  Bottom 0.508: PH1.2 32.18,27.1 R7.2
PR_2
  Bottom 0.508: PH2.2 35.56,14.81 R6.1 35.56,27.94 38.1,30.48 46.99,30.48 48.26,31.75 48.26,36.83 49.53,38.1 52.99,38.1 57.15,42.26 TEENSY3.6.14/A0
PR_3
  Bottom 0.508: 28.19,57.15 28.19,59.87 23.29,64.77 PH3.2 | 28.19,57.15 21.59,50.55 R8.1 | TEENSY3.6.23/A9 28.19,56.9 28.19,57.15
PR_4
  Top 0.508: PH4.2 27.94,53.77 R9.1 34.29,46.99 39.37,46.99 41.91,49.53 TEENSY3.6.20/A6
SCL
  Top 0.61: BNO055_H1.5 63.5,24.76 63.5,39.37 TEENSY3.6.37/A18
SDA
  Top 0.61: BNO055_H1.4 58.42,22.22 58.42,36.83 TEENSY3.6.38/A19
V_BATT
  Top 2.54: U$5.+ 6.35,13.39 C10.1 6.35,24.13 5V_REG.1
  Bottom 1.27: U$5.+ 9.65,10.06 14.28,5.44 30.84,5.44 46.99,21.59 R1.2
XBEE_EN
  Bottom 0.813: TEENSY3.6.28 79.17,31.32 XB1.4
XBEE_RST
  Top 0.813: XB1.5 77.2,32.02 76.2,33.02 73.66,33.02 72.39,34.29 TEENSY3.6.27
XBEE_RX
  Top 0.813: TEENSY3.6.32/A13 81.2,31.67 XB1.3
XBEE_TX
  Bottom 0.813: TEENSY3.6.31/A12 82.55,31.97 XB1.2

### Text on the board
tPlace: VIN | GND | SDO | CS | INT | BNO055 | Vin | 3vo | GND | SDA | SCL | RST
tNames: University of Pittsburgh SOAR / Avionics Team 2019-2020